# EAGLE schematic 808_cowbell (EAGLE 7.1.0)
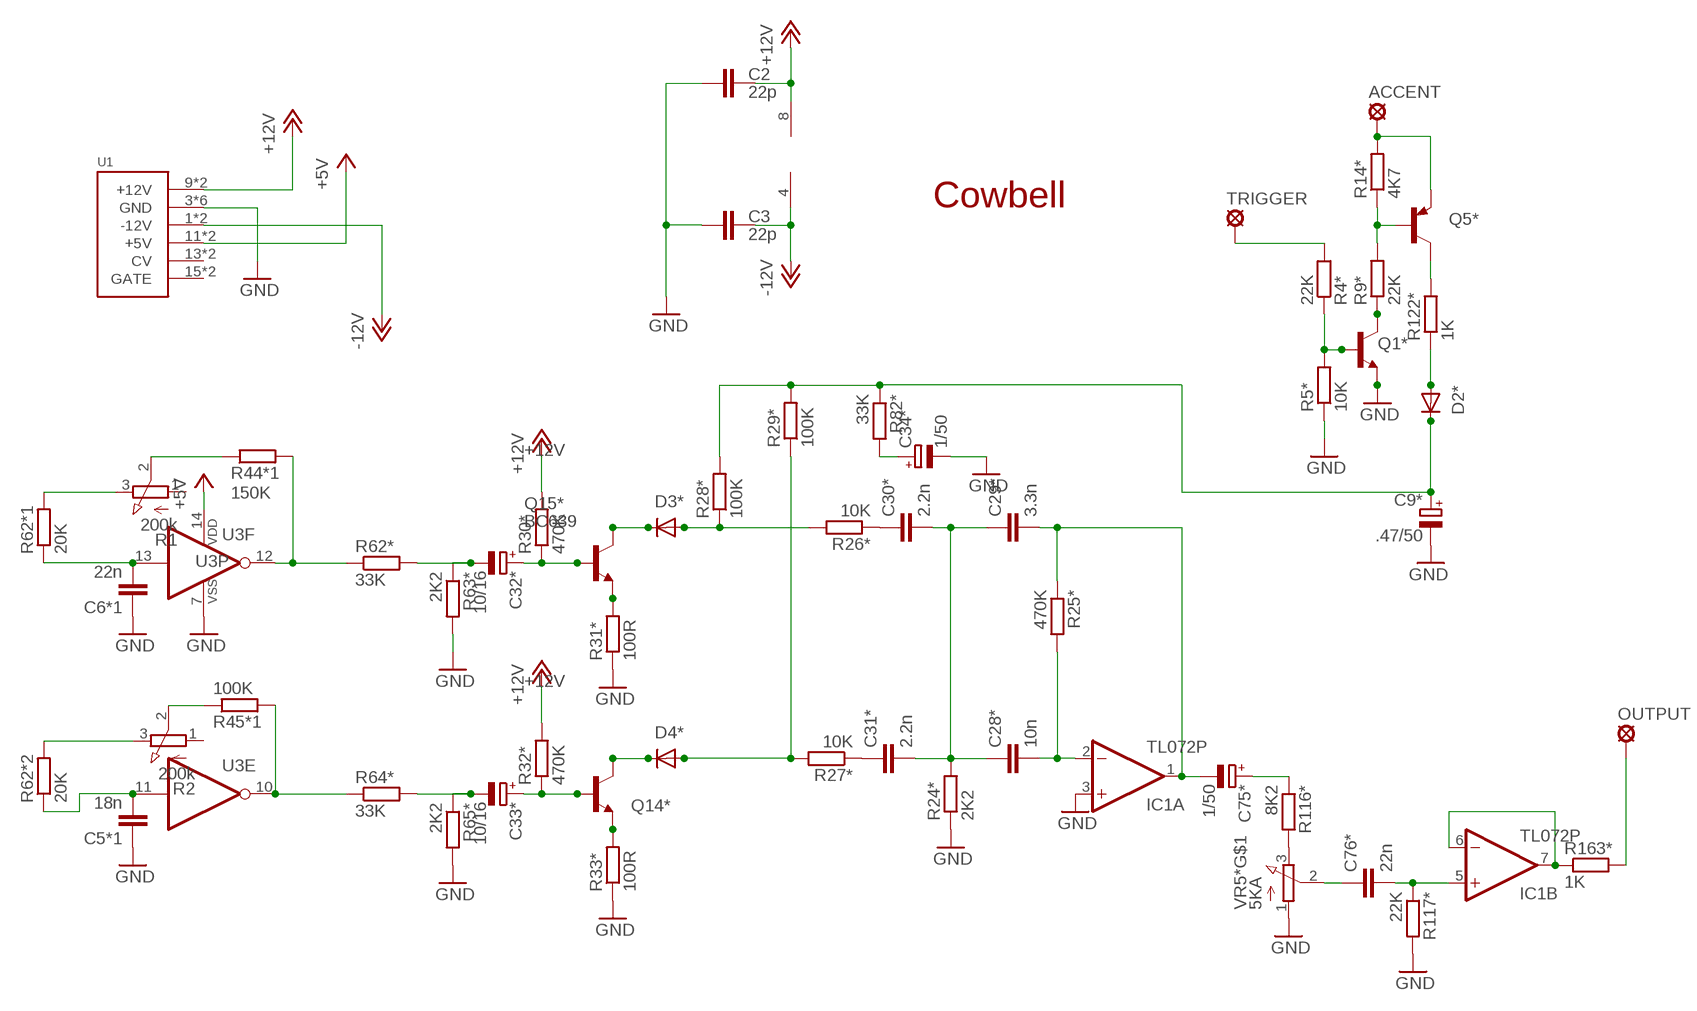
[diagram p0: schematic, sheet 1]

## Parts
ACCENT  LSP11  [LSP11]
C2  22p  C-EU025-025X050  [C025-025X050]
C3  22p  C-EU025-025X050  [C025-025X050]
C5*1  18n  C-EU4MM_PITCH  [C035-030X60]
C6*1  22n  C-EU4MM_PITCH  [C035-030X60]
C9*  .47/50  CPOL-EUE2.5-5  [E2,5-5]
C28*  10n  C-EU3.5MM_PITCH  [C035-025X75]
C29*  3.3n  C-EU3.5MM_PITCH  [C035-025X75]
C30*  2.2n  C-EU3.5MM_PITCH  [C035-025X75]
C31*  2.2n  C-EU3.5MM_PITCH  [C035-025X75]
C32*  10/16  CPOL-EUE2.5-5  [E2,5-5]
C33*  10/16  CPOL-EUE2.5-5  [E2,5-5]
C34*  1/50  CPOL-EUE2.5-5  [E2,5-5]
C75*  1/50  CPOL-EUE2.5-5  [E2,5-5]
C76*  22n  C-EU4MM_PITCH  [C035-030X60]
D2*  1N4148DO35-7  [DO35-7]
D3*  1N4148DO35-7  [DO35-7]
D4*  1N4148DO35-7  [DO35-7]
IC1  TL072P  [DIL08]
OUTPUT  LSP11  [LSP11]
Q1*  BC639  BC639-NPN-TO92-ECB  [TO92-ECB]
Q5*  BC640  BC640-PNP-TO92-BCE  [TO92-BCE]
Q14*  BC639  BC639-NPN-TO92-ECB  [TO92-ECB]
Q15*  BC639  BC639-NPN-TO92-ECB  [TO92-ECB]
R1  200k  3RP/1610N  [3RP/1610N]
R2  200k  3RP/1610N  [3RP/1610N]
R4*  22K  R-EU_0207/5V  [0207/5V]
R5*  10K  R-EU_0207/5V  [0207/5V]
R9*  22K  R-EU_0207/5V  [0207/5V]
R14*  4K7  R-EU_0207/5V  [0207/5V]
R24*  2K2  R-EU_0207/5V  [0207/5V]
R25*  470K  R-EU_0207/5V  [0207/5V]
R26*  10K  R-EU_0207/5V  [0207/5V]
R27*  10K  R-EU_0207/2V  [0207/2V]
R28*  100K  R-EU_0207/5V  [0207/5V]
R29*  100K  R-EU_0207/5V  [0207/5V]
R30*  470K  R-EU_0207/5V  [0207/5V]
R31*  100R  R-EU_0207/5V  [0207/5V]
R32*  470K  R-EU_0207/5V  [0207/5V]
R33*  100R  R-EU_0207/5V  [0207/5V]
R44*1  150K  R-EU_0207/5V  [0207/5V]
R45*1  100K  R-EU_0207/5V  [0207/5V]
R62*  33K  R-EU_0207/5V  [0207/5V]
R62*1  20K  R-EU_0207/5V  [0207/5V]
R62*2  20K  R-EU_0207/5V  [0207/5V]
R63*  2K2  R-EU_0207/5V  [0207/5V]
R64*  33K  R-EU_0207/5V  [0207/5V]
R65*  2K2  R-EU_0207/5V  [0207/5V]
R82*  33K  R-EU_0207/5V  [0207/5V]
R116*  8K2  R-EU_0207/5V  [0207/5V]
R117*  22K  R-EU_0207/5V  [0207/5V]
R122*  1K  R-EU_0207/5V  [0207/5V]
R163*  1K  R-EU_0207/5V  [0207/5V]
TRIGGER  LSP11  [LSP11]
U1  POWER  [POWER_16]
U3  4584N  [DIL14]
VR5*  5KA  POT_808  [R1212N]

## Nets
+5V: U1.11(+5V) U1.12(+5V) U3.14(P:VDD)
+12V [Power]: C2.2 IC1.8(P:V+) R30*.2 R32*.2 U1.9(+12V) U1.10(+12V)
-12V: C3.2 IC1.4(P:V-) U1.1(-12V) U1.2(-12V)
CB_OUT: OUTPUT.MP R163*.2
GND [GND]: C2.1 C3.1 C5*1.P$1 C6*1.P$1 C9*.- C34*.- IC1.3(A:+IN) Q1*.E R5*.1 R24*.1 R31*.1 R33*.1 R63*.2 R65*.2 R117*.2 U1.3(GND) U1.4(GND) U1.5(GND) U1.6(GND) U1.7(GND) U1.8(GND) U3.7(P:VSS) VR5*.1(A)
N$1: C5*1.P$2 R62*2.1 U3.11(E:I)
N$2: C6*1.P$2 R62*1.1 U3.13(F:I)
N$3: R2.2(S) R45*1.1
N$4: R1.2(S) R44*1.1
N$5: R44*1.2 R62*.1 U3.12(F:O)
N$6: R1.3(E) R62*1.2
N$7: R2.3(E) R62*2.2
N$441: Q5*.B R9*.2 R14*.1
N$442: Q1*.C R9*.1
N$443: Q1*.B R4*.1 R5*.2
N$444: C9*.+ D2*.C R28*.2 R29*.2 R82*.1
N$445: Q15*.E R31*.2
N$446: C32*.+ Q15*.B R30*.1
N$447: D3*.C Q15*.C
N$448: D3*.A R26*.2 R28*.1
N$449: Q14*.E R33*.2
N$450: C33*.+ Q14*.B R32*.1
N$451: D4*.C Q14*.C
N$452: D4*.A R27*.2 R29*.1
N$453: C30*.P$1 R26*.1
N$454: C31*.P$1 R27*.1
N$455: C28*.P$1 C29*.P$1 C30*.P$2 C31*.P$2 R24*.2
N$456: C29*.P$2 C75*.- IC1.1(A:OUT) R25*.1
N$457: C28*.P$2 IC1.2(A:-IN) R25*.2
N$458: IC1.6(B:-IN) IC1.7(B:OUT) R163*.1
N$459: C76*.P$2 IC1.5(B:+IN) R117*.1
N$460: C76*.P$1 VR5*.2(S)
N$461: R116*.2 VR5*.3(E)
N$462: C75*.+ R116*.1
N$464: C32*.- R62*.2 R63*.1
N$465: C33*.- R64*.2 R65*.1
N$466: C34*.+ R82*.2
N$467: Q5*.C R122*.2
N$468: D2*.A R122*.1
TP7: R45*1.2 R64*.1 U3.10(E:O)
TRIG: R4*.2 TRIGGER.MP
TRIG*: ACCENT.MP Q5*.E R14*.2
Unconnected: R1.1(A) R2.1(A) U1.13(CV) U1.14(CV) U1.15(GATE) U1.16(GATE) U3.1(A:I) U3.2(A:O) U3.3(B:I) U3.4(B:O) U3.5(C:I) U3.6(C:O) U3.8(D:O) U3.9(D:I) VR5*.P$4(C) VR5*.P$5(C)

## Notes on the sheet
- Cowbell

## Library data of the parts
ACCENT OUTPUT TRIGGER = solpad:LSP11: SOLDER PAD drill 1.1 mm
C2 C3 C5*1 C6*1 C28* C29* C30* C31* C76* = TR808clone:C-EU: CAPACITOR, European symbol Pitch 3mm
C9* C32* C33* C34* C75* = TR808clone:CPOL-EU: POLARIZED CAPACITOR, European symbol
D2* D3* D4* = TR808clone:1N4148: DIODE high speed (Philips)
IC1 = linear:TL072: OP AMP
Q1* Q14* Q15* = transistor:*-NPN-: NPN Transistror BF959 corrected 2008.03.06
Q5* = transistor:*-PNP-: PNP Transistror
R1 R2 = pot:3RP/1610N: 16mm Potentiometer one level Source: http://www.alphapotentiometers.net/html/16mm_pot_2.html
R4* R5* R9* R14* R24* R25* R26* R27* R28* R29* R30* R31* R32* R33* R44*1 R45*1 R62* R62*1 R62*2 R63* R64* R65* R82* R116* R117* R122* R163* = TR808clone:R-EU_: RESISTOR, European symbol
U1 = eurorack:POWER
U3 = TR808clone:4584: Hex SCHMITT TRIGGER (74C14)
VR5* = TR808clone:POT_808

## Net classes
0 default: width 0.635 mm, drill 0.254 mm, clearance 0.254 mm
1 GND: width 1.016 mm, drill 1.016 mm, clearance 0.508 mm
2 Power: width 1.016 mm, drill 1.016 mm, clearance 0.508 mm
3 special: width 0.635 mm, drill 0.254 mm, clearance 0.254 mm
4 15v: width 1.524 mm, drill 1.016 mm, clearance 0.508 mm